# Altium schematic sheet 07-AudioAmplifier(TDA7297).SchDoc
size A
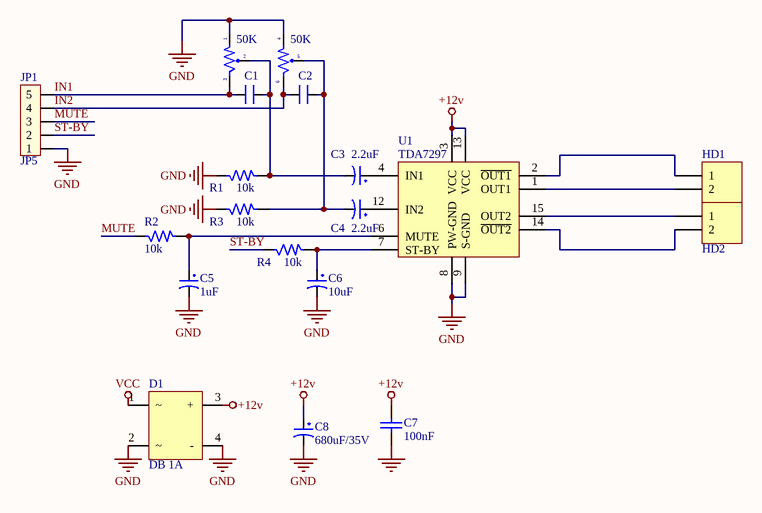
[diagram p0: 07-AudioAmplifier(TDA7297).SchDoc]

## Parts
C1  220nF  [C-0805]  (value not drawn)
C2  220nF  [C-0805]  (value not drawn)
C3  2.2uF  [ALU-4X5mm]
C4  2.2uF  [ALU-4X5mm]
C5  1uF  [ALU-4X5mm]
C6  10uF  [ALU-4X5mm]
C7  value 100nF  [RAD-0.3]  (hidden comment: 104)
C8  680uF/35V  [C-16x26mm]
D1  DB 1A  [D-DB-DF06S-E3-45]
HD1  Header 2  [TER-KF301-2]  (value not drawn)
HD2  Header 2  [TER-KF301-2]  (value not drawn)
JP1  JP5  [JP5]
R1  10k  [R-0805]
R2  10k  [R-0805]
R3  10k  [R-0805]
R4  10k  [R-0805]
U1  TDA7297  [MULTIWATT-15V]
VOL1  50K  [VOL-D]  (parts A,B of 2)

## Nets
+12v: C7.1 C8.1 D1.3(+) U1.3(VCC) U1.13(VCC)
GND: C5.2 C6.2 C7.2 C8.2 D1.2 D1.4(-) JP1.1 R1.1 R3.1 U1.8(PW-GND) U1.9(S-GND) VOL1.1 VOL1.4
VCC: D1.1
IN1: C1.2 JP1.5 VOL1.3
IN2: C2.2 JP1.4 VOL1.6
MUTE: JP1.3 R2.1
ST-BY: JP1.2 R4.1
NetC1_1: C1.1 C3.2 R1.2 VOL1.2
NetC2_1: C2.1 C4.2 R3.2 VOL1.5
NetC3_1: C3.1 U1.4(IN1)
NetC4_1: C4.1 U1.12(IN2)
NetC5_1: C5.1 R2.2 U1.6(MUTE)
NetC6_1: C6.1 R4.2 U1.7(ST-BY)
NetHD1_1: HD1.1 U1.2(~{OUT1})
NetHD1_2: HD1.2 U1.1(OUT1)
NetHD2_1: HD2.1 U1.15(OUT2)
NetHD2_2: HD2.2 U1.14(~{OUT2})

Not connected (* = marked no-connect by the designer): U1 5(NC) 10(NC) 11(NC)

## Library data of the parts
C1 C2 = CN: Value: 0,1uF/300V; Designed by: VanDungEvn
C3-C6 = CP1: Cap P  0,1uF < 22uF , 16 - 50V; Value: 10uF/50V; Description 1: 10 => 220uF/6,3V/10V - 10uF => 100uF/16V; Description 2: 0,1uF => 33uF/50V - 10uF => 22uF/63V; Description 3: 0,47uF => 10uF/100V
C7 = Cap: Capacitor; Published: 8-Jun-2000; LatestRevisionDate: 17-Jul-2002; LatestRevisionNote: Re-released for DXP Platform.; PackageReference: RAD-0.3; Publisher: Altium Limited; PackageDescription: Radial Cap, Thru-Hole; 2 Leads; 0.3 in Pin Spacing
C8 = CP4: Cap 1000uF/16V - 220uF/50V; Description 5: 4,7uF>10uF/250V_3,3uF>10uF/400V - 2,2uF>4,7uF/450V; Description 1: 2200uF-3300uF/6,3V - 1000uF-2200uF/10V; Description 2: 1000uF/16V - 470uF => 1000uF/25V - 100uF/100V; Description 3: 330uF>470uF/35V_220uF>470uF/50V_10uF>22uF/250V; Description 4: 220uF => 330uF/63V - 10uF =>33uF/160 - 200V; Value: 1000uF/16V
D1 = DB
HD1 HD2 = Header 2: Header, 2-Pin; Manufacturer: Generic Components; Class: Connector; Value: Header 2
R1-R4 = R: Resistor 1/4W; Value: R1/4W - 1K
VOL1 = VOL-D: Volume control Dual; Value: Volume Dual 50K
U1 = TDA7297: Value: TDA7297